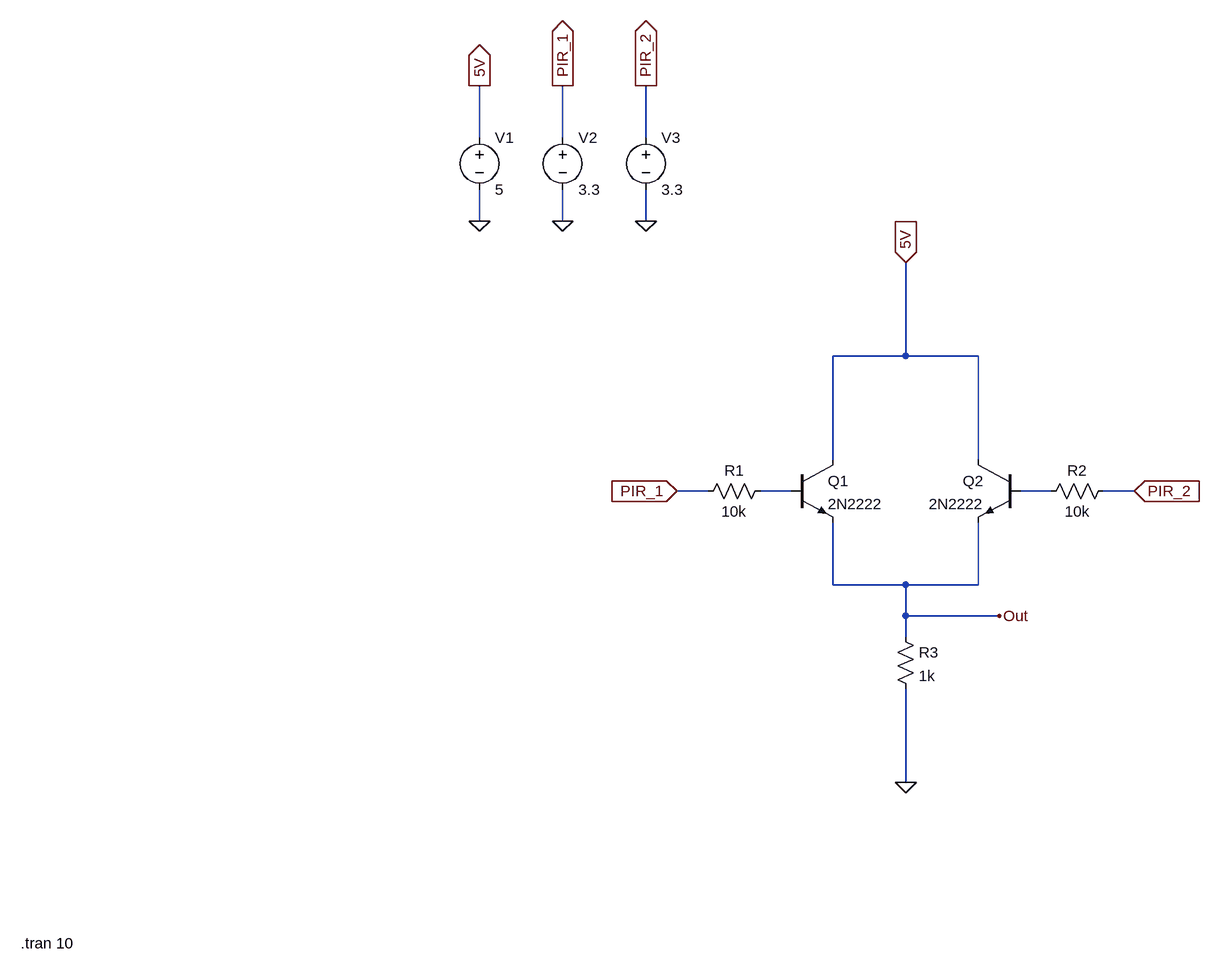
[diagram p0: schematic OR_gate_revision_2.asc]
OR_gate_revision_2.asc, the LTspice schematic file:
Version 4
SHEET 1 1428 824
WIRE 288 -432 288 -512
WIRE 416 -432 416 -512
WIRE 544 -432 544 -512
WIRE 288 -304 288 -352
WIRE 416 -304 416 -352
WIRE 544 -304 544 -352
WIRE 944 -96 944 -240
WIRE 944 -96 832 -96
WIRE 1056 -96 944 -96
WIRE 832 64 832 -96
WIRE 1056 64 1056 -96
WIRE 640 112 592 112
WIRE 768 112 720 112
WIRE 1168 112 1120 112
WIRE 1296 112 1248 112
WIRE 832 256 832 160
WIRE 944 256 832 256
WIRE 1056 256 1056 160
WIRE 1056 256 944 256
WIRE 944 304 944 256
WIRE 1088 304 944 304
WIRE 944 336 944 304
WIRE 944 560 944 416
FLAG 288 -304 0
FLAG 288 -512 5V
IOPIN 288 -512 Out
FLAG 944 -240 5V
IOPIN 944 -240 In
FLAG 1088 304 Out
FLAG 592 112 PIR_1
IOPIN 592 112 In
FLAG 1296 112 PIR_2
IOPIN 1296 112 In
FLAG 416 -304 0
FLAG 416 -512 PIR_1
IOPIN 416 -512 Out
FLAG 544 -304 0
FLAG 544 -512 PIR_2
IOPIN 544 -512 Out
FLAG 944 560 0
SYMBOL npn 768 64 R0
SYMATTR InstName Q1
SYMATTR Value 2N2222
SYMBOL npn 1120 64 M0
SYMATTR InstName Q2
SYMATTR Value 2N2222
SYMBOL res 736 96 R90
WINDOW 0 0 56 VBottom 2
WINDOW 3 32 56 VTop 2
SYMATTR InstName R1
SYMATTR Value 10k
SYMBOL res 1264 96 R90
WINDOW 0 0 56 VBottom 2
WINDOW 3 32 56 VTop 2
SYMATTR InstName R2
SYMATTR Value 10k
SYMBOL voltage 288 -448 R0
WINDOW 123 0 0 Left 0
WINDOW 39 0 0 Left 0
SYMATTR InstName V1
SYMATTR Value 5
SYMBOL res 928 320 R0
SYMATTR InstName R3
SYMATTR Value 1k
SYMBOL voltage 416 -448 R0
WINDOW 123 0 0 Left 0
WINDOW 39 0 0 Left 0
SYMATTR InstName V2
SYMATTR Value 3.3
SYMBOL voltage 544 -448 R0
WINDOW 123 0 0 Left 0
WINDOW 39 0 0 Left 0
SYMATTR InstName V3
SYMATTR Value 3.3
TEXT -418 808 Left 2 !.tran 10

The netlist it stands for:
* OR_gate_revision_2.asc
Q1 5V N001 Out 0 2N2222
Q2 5V N002 Out 0 2N2222
R1 N001 PIR_1 10k
R2 PIR_2 N002 10k
V1 5V 0 5
R3 Out 0 1k
V2 PIR_1 0 3.3
V3 PIR_2 0 3.3
.model NPN NPN
.model PNP PNP
.lib standard.bjt
.tran 10
.backanno
.end